# Altium schematic sheet FInk.SchDoc
size A4
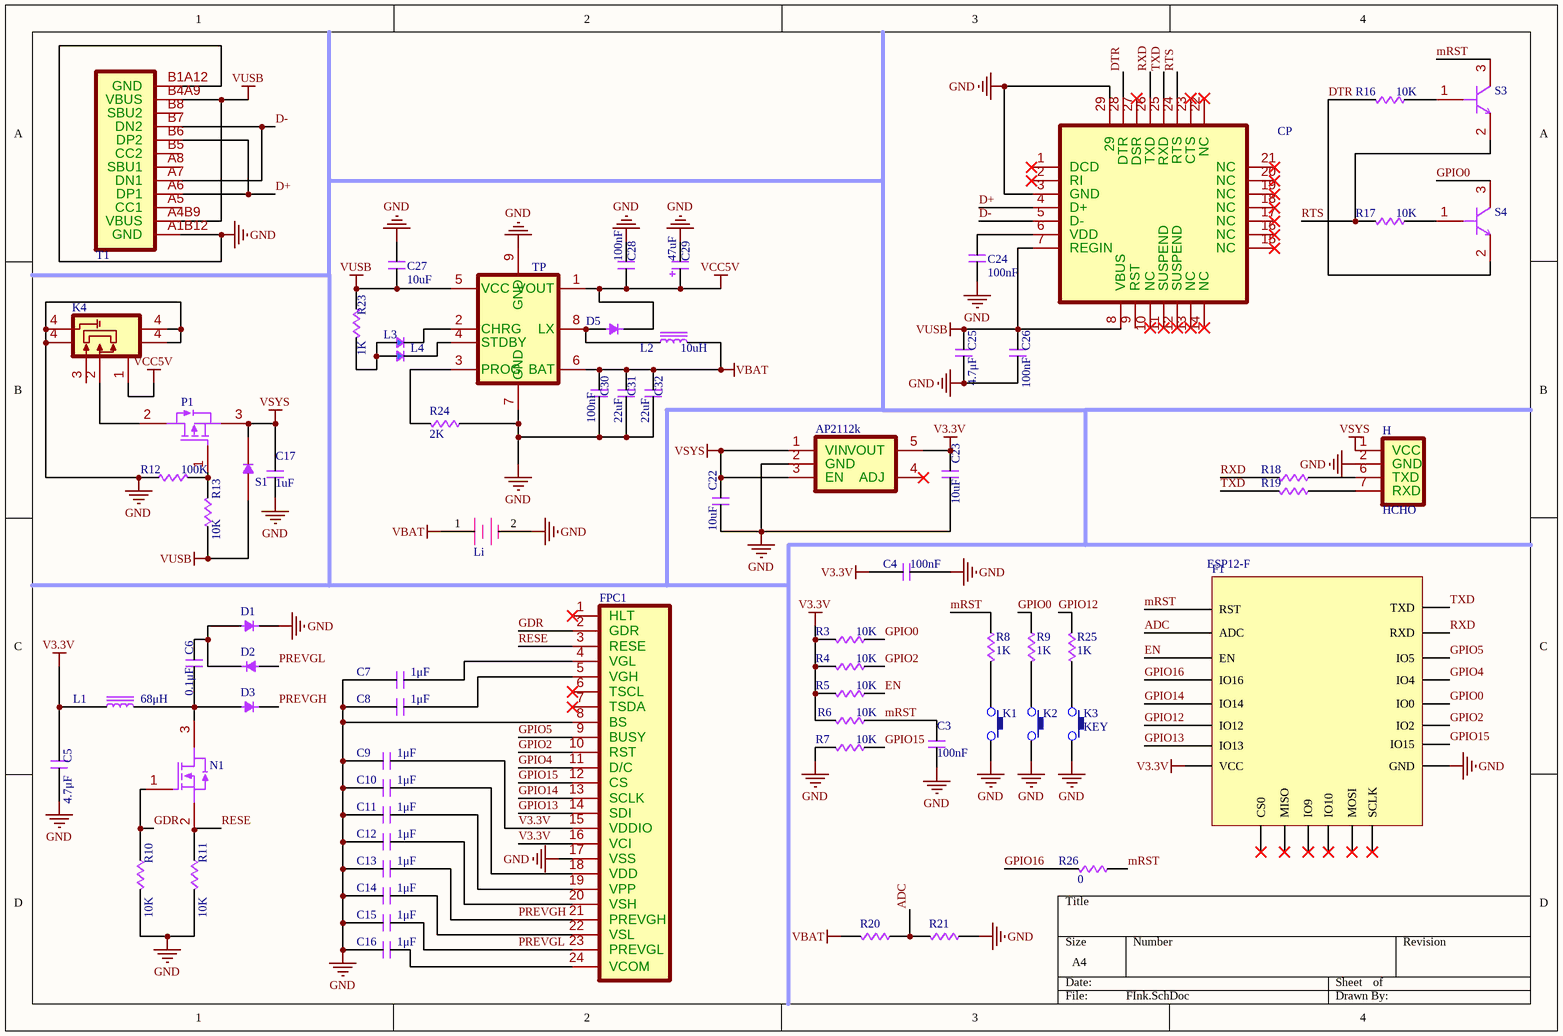
[diagram p0: FInk.SchDoc]

## Parts
AP2112k  SPX3819 电源芯片  [SOT_23_SPX3819]  (value not drawn)
C3  value 100nF  [0603_C]  (hidden comment: 0603_C)
C4  value 100nF  [0603_C]  (hidden comment: 0603_C)
C5  value 4.7μF  [0603_C]  (hidden comment: 0603_C)
C6  value 0.1μF  [0603_C]  (hidden comment: 0603_C)
C7  value 1μF  [0603_C]  (hidden comment: 0603_C)
C8  value 1μF  [0603_C]  (hidden comment: 0603_C)
C9  value 1μF  [0603_C]  (hidden comment: 0603_C)
C10  value 1μF  [0603_C]  (hidden comment: 0603_C)
C11  value 1μF  [0603_C]  (hidden comment: 0603_C)
C12  value 1μF  [0603_C]  (hidden comment: 0603_C)
C13  value 1μF  [0603_C]  (hidden comment: 0603_C)
C14  value 1μF  [0603_C]  (hidden comment: 0603_C)
C15  value 1μF  [0603_C]  (hidden comment: 0603_C)
C16  value 1μF  [0603_C]  (hidden comment: 0603_C)
C17  value 1uF  [0603_C]  (hidden comment: 0603_C)
C22  value 10uF  [0603_C]  (hidden comment: 0603_C)
C23  value 10uF  [0603_C]  (hidden comment: 0603_C)
C24  value 100nF  [0603_C]  (hidden comment: 0603_C)
C25  value 4.7μF  [0603_C]  (hidden comment: 0603_C)
C26  value 100nF  [0603_C]  (hidden comment: 0603_C)
C27  value 10uF  [0603_C]  (hidden comment: 0603_C)
C28  value 100nF  [0603_C]  (hidden comment: 0603_C)
C29  value 47uF  [A_CASE_c]  (hidden comment: A_CASE_C)
C30  value 100nF  [0603_C]  (hidden comment: 0603_C)
C31  value 22uF  [0603_C]  (hidden comment: 0603_C)
C32  value 22uF  [0603_C]  (hidden comment: 0603_C)
CP  CP2102  [CP2102]  (value not drawn)
D1  MBR0530  [SOD-123]  (value not drawn)
D2  MBR0530  [SOD-123]  (value not drawn)
D3  MBR0530  [SOD-123]  (value not drawn)
D5  SMA(SS32)  [SMA(ss32)]  (value not drawn)
F1  ESP12-F  [ESP-12F]
FPC1  CONECT  [FPC 24PIN]  (value not drawn)
H  HCHO  [HCHO]
K1  KEY  [KEY]  (value not drawn)
K2  K2  [KEY]  (value not drawn)
K3  KEY  [KEY]
K4  Key  [MS_key]  (value not drawn)
L1  value 68μH  [CDRH4D18]  (hidden comment: SMD_H)
L2  value 10uH  [CDRH4D18]  (hidden comment: SMD_H)
L3  0603_L  [0603_LED]  (value not drawn)
L4  0603_L  [0603_LED]  (value not drawn)
Li  Li_Po  [Li_Po]  (value not drawn)
N1  NMOS  [SOT-23-3]  (value not drawn)
P1  PMOS  [PMOS]  (value not drawn)
R3  value 10K  [0603_R]  (hidden comment: 0603_R)
R4  value 10K  [0603_R]  (hidden comment: 0603_R)
R5  value 10K  [0603_R]  (hidden comment: 0603_R)
R6  value 10K  [0603_R]  (hidden comment: 0603_R)
R7  value 10K  [0603_R]  (hidden comment: 0603_R)
R8  value 1K  [0603_R]  (hidden comment: 0603_R)
R9  value 1K  [0603_R]  (hidden comment: 0603_R)
R10  value 10K  [0603_R]  (hidden comment: 0603_R)
R11  value 10K  [0603_R]  (hidden comment: 0603_R)
R12  value 100K  [0603_R]  (hidden comment: 0603_R)
R13  value 10K  [0603_R]  (hidden comment: 0603_R)
R16  value 10K  [0603_R]  (hidden comment: 0603_R)
R17  value 10K  [0603_R]  (hidden comment: 0603_R)
R18  0603_R  [0603_R]  (value not drawn)
R19  0603_R  [0603_R]  (value not drawn)
R20  0603_R  [0603_R]  (value not drawn)
R21  0603_R  [0603_R]  (value not drawn)
R23  value 1K  [0603_R]  (hidden comment: 0603_R)
R24  value 2K  [0603_R]  (hidden comment: 0603_R)
R25  value 1K  [0603_R]  (hidden comment: 0603_R)
R26  value 0  [0603_R]  (hidden comment: 0603_R)
S1  SOD323  [SOD-123]  (value not drawn)
S3  NPN  [SOT-23-3]  (value not drawn)
S4  NPN  [SOT-23-3]  (value not drawn)
T1  typec  [TYPEC]  (value not drawn)
TP  TP5400  [SOIC8]  (value not drawn)

## Nets
GND: AP2112k.2(GND) C3.1 C4.2 C5.1 C7.1 C8.1 C9.1 C10.1 C11.1 C12.1 C13.1 C14.1 C15.1 C16.1 C17.1 C22.1 C23.1 C24.1 C25.1 C26.1 C27.2 C28.2 C29.2 C30.1 C31.1 C32.1 CP.3(GND) CP.29 D1.2 F1.15(GND) FPC1.8(BS) FPC1.17(VSS) H.2(GND) K1.2 K2.2 K3.2 K4.4 Li.2(-) R7.1 R10.1 R11.1 R12.2 R21.2 R24.2 T1.A1B12(GND) T1.B1A12(GND) TP.7(GND) TP.9(GND)
V3.3V: AP2112k.5(VOUT) C4.1 C5.2 C9.2 C23.2 F1.8(VCC) FPC1.15(VDDIO) FPC1.16(VCI) L1.1 R3.1 R4.1 R5.1 R6.1
VBAT: C30.2 C31.2 C32.2 L2.2 Li.1(+) R20.1 TP.6(BAT)
VCC5V: C28.1 C29.1 D5.2 K4.1 TP.1(VOUT)
VSYS: AP2112k.1(VIN) AP2112k.3(EN) C17.2 C22.2 H.1(VCC) P1.3(S) S1.2
VUSB: C25.2 C26.2 C27.1 CP.7(REGIN) CP.8(VBUS) R13.2 R23.2 S1.1 T1.A4B9(VBUS) T1.B4A9(VBUS) TP.5(VCC)
ADC: F1.2(ADC) R20.2 R21.1
D+: CP.4(D+) T1.A6(DP1) T1.B6(DP2)
D-: CP.5(D-) T1.A7(DN1) T1.B7(DN2)
DTR: CP.28(DTR) R16.1 S4.2(E)
EN: F1.3(EN) R5.2
GDR: FPC1.2(GDR) N1.1(G) R10.2
GPIO0: F1.18(IO0) R3.2 R9.2 S4.3(C)
GPIO2: F1.17(IO2) FPC1.10(RST) R4.2
GPIO4: F1.19(IO4) FPC1.11(D/C)
GPIO5: F1.20(IO5) FPC1.9(BUSY)
GPIO12: F1.6(IO12) R25.1
GPIO13: F1.7(IO13) FPC1.14(SDI)
GPIO14: F1.5(IO14) FPC1.13(SCLK)
GPIO15: F1.16(IO15) FPC1.12(CS) R7.2
GPIO16: F1.4(IO16) R26.1
mRST: C3.2 F1.1(RST) R6.2 R8.2 R26.2 S3.3(C)
PREVGH: C13.2 D3.2 FPC1.21(PREVGH)
PREVGL: C15.2 D2.1 FPC1.23(PREVGL)
RESE: FPC1.3(RESE) N1.2(S) R11.2
RTS: CP.24(RTS) R17.1 S3.2(E)
RXD: CP.26(TXD) F1.21(RXD) R18.1
TXD: CP.25(RXD) F1.22(TXD) R19.1
NetC6_1: C6.1 D3.1 L1.2 N1.3(D)
NetC6_2: C6.2 D1.1 D2.2
NetC7_2: C7.2 FPC1.4(VGL)
NetC8_2: C8.2 FPC1.5(VGH)
NetC10_2: C10.2 FPC1.18(VDD)
NetC11_2: C11.2 FPC1.19(VPP)
NetC12_2: C12.2 FPC1.20(VSH)
NetC14_2: C14.2 FPC1.22(VSL)
NetC16_2: C16.2 FPC1.24(VCOM)
NetC24_2: C24.2 CP.6(VDD)
NetD5_1: D5.1 L2.1 TP.8(LX)
NetH_6: H.6(TXD) R18.2
NetH_7: H.7(RXD) R19.2
NetK1_1: K1.1 R8.1
NetK2_1: K2.1 R9.1
NetK3_1: K3.1 R25.2
NetK4_2: K4.2 P1.2(D)
NetL3_1: L3.1(+) L4.1(+) R23.1
NetL3_2: L3.2 TP.2(CHRG)
NetL4_2: L4.2 TP.4(STDBY)
NetP1_1: P1.1(G) R12.1 R13.1
NetR16_2: R16.2 S3.1(B)
NetR17_2: R17.2 S4.1(B)
NetR24_1: R24.1 TP.3(PROG)

Not connected (* = marked no-connect by the designer): AP2112k 4(ADJ)*; CP 1(DCD) 2(RI) 9(RST) 10(NC)* 11(SUSPEND)* 12(SUSPEND)* 13(NC)* 14(NC)* 15(NC)* 16(NC)* 17(NC)* 18(NC)* 19(NC)* 20(NC)* 21(NC)* 22(NC)* 23(CTS)* 27(DSR)*; F1 9(CS0)* 10(MISO)* 11(IO9)* 12(IO10)* 13(MOSI)* 14(SCLK)*; FPC1 1(HLT)* 6(TSCL)* 7(TSDA)*; K4 3; T1 A5(CC1) A8(SBU1) B5(CC2) B8(SBU2)

## Library data of the parts
D1-D3 = SOD_123(肖基特二极管）
F1 = ESP_12_E
FPC1 = 24PIN CONNECT
K2 = KEY
K4 = MSK12C02
L1 L2 = SMD_H( 电感）
L3 L4 = 0603_LED
Li = LIPO
R18 R19 = 0603_R: value: 0
T1 = TYPE-C
TP = TP5400(SOIC8)